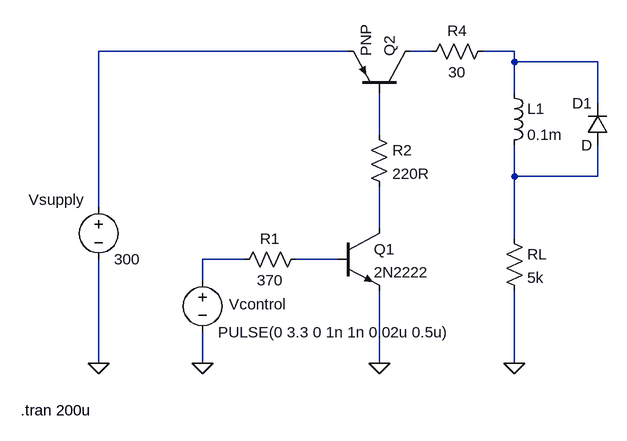
[diagram p0: schematic stim_controller.asc]
stim_controller.asc, the LTspice schematic file:
Version 4
SHEET 1 880 680
WIRE 16 -128 -368 -128
WIRE 144 -128 112 -128
WIRE 272 -128 224 -128
WIRE 272 -112 272 -128
WIRE 400 -112 272 -112
WIRE 272 -64 272 -112
WIRE 400 -48 400 -112
WIRE 64 0 64 -64
WIRE 272 64 272 16
WIRE 400 64 400 16
WIRE 400 64 272 64
WIRE -368 112 -368 -128
WIRE 64 144 64 80
WIRE 272 160 272 64
WIRE -144 192 -208 192
WIRE 0 192 -64 192
WIRE -208 224 -208 192
WIRE -368 352 -368 192
WIRE -208 352 -208 304
WIRE 64 352 64 240
WIRE 272 352 272 240
FLAG 64 352 0
FLAG -208 352 0
FLAG -368 352 0
FLAG 272 352 0
SYMBOL npn 0 144 R0
SYMATTR InstName Q1
SYMATTR Value 2N2222
SYMBOL ind 256 -80 R0
SYMATTR InstName L1
SYMATTR Value 0.1m
SYMBOL res -48 176 R90
WINDOW 0 0 56 VBottom 2
WINDOW 3 32 56 VTop 2
SYMATTR InstName R1
SYMATTR Value 370
SYMBOL voltage -208 208 R0
WINDOW 0 41 53 Left 2
WINDOW 123 0 0 Left 2
WINDOW 39 0 0 Left 2
SYMATTR InstName Vcontrol
SYMATTR Value PULSE(0 3.3 0 1n 1n 0.02u 0.5u)
SYMBOL voltage -368 96 R0
WINDOW 0 -108 4 Left 2
WINDOW 123 0 0 Left 2
WINDOW 39 0 0 Left 2
SYMATTR InstName Vsupply
SYMATTR Value 300
SYMBOL res 256 144 R0
SYMATTR InstName RL
SYMATTR Value 5k
SYMBOL pnp 112 -64 M270
SYMATTR InstName Q2
SYMBOL res 48 -16 R0
SYMATTR InstName R2
SYMATTR Value 220R
SYMBOL diode 416 16 R180
WINDOW 0 24 64 Left 2
WINDOW 3 24 0 Left 2
SYMATTR InstName D1
SYMBOL res 240 -144 R90
WINDOW 0 0 56 VBottom 2
WINDOW 3 32 56 VTop 2
SYMATTR InstName R4
SYMATTR Value 30
TEXT -488 424 Left 2 !.tran 200u

The netlist it stands for:
* stim_controller.asc
Q1 N006 N008 0 0 2N2222
L1 N003 N005 0.1m
R1 N008 N007 370
Vcontrol N007 0 PULSE(0 3.3 0 1n 1n 0.02u 0.5u)
Vsupply N001 0 300
RL N005 0 5k
Q2 N002 N004 N001 0 PNP
R2 N004 N006 220R
D1 N005 N003 D
R4 N003 N002 30
.model D D
.lib standard.dio
.model NPN NPN
.model PNP PNP
.lib standard.bjt
.tran 200u
.backanno
.end